# Altium schematic sheet CORE.SchDoc
size A3
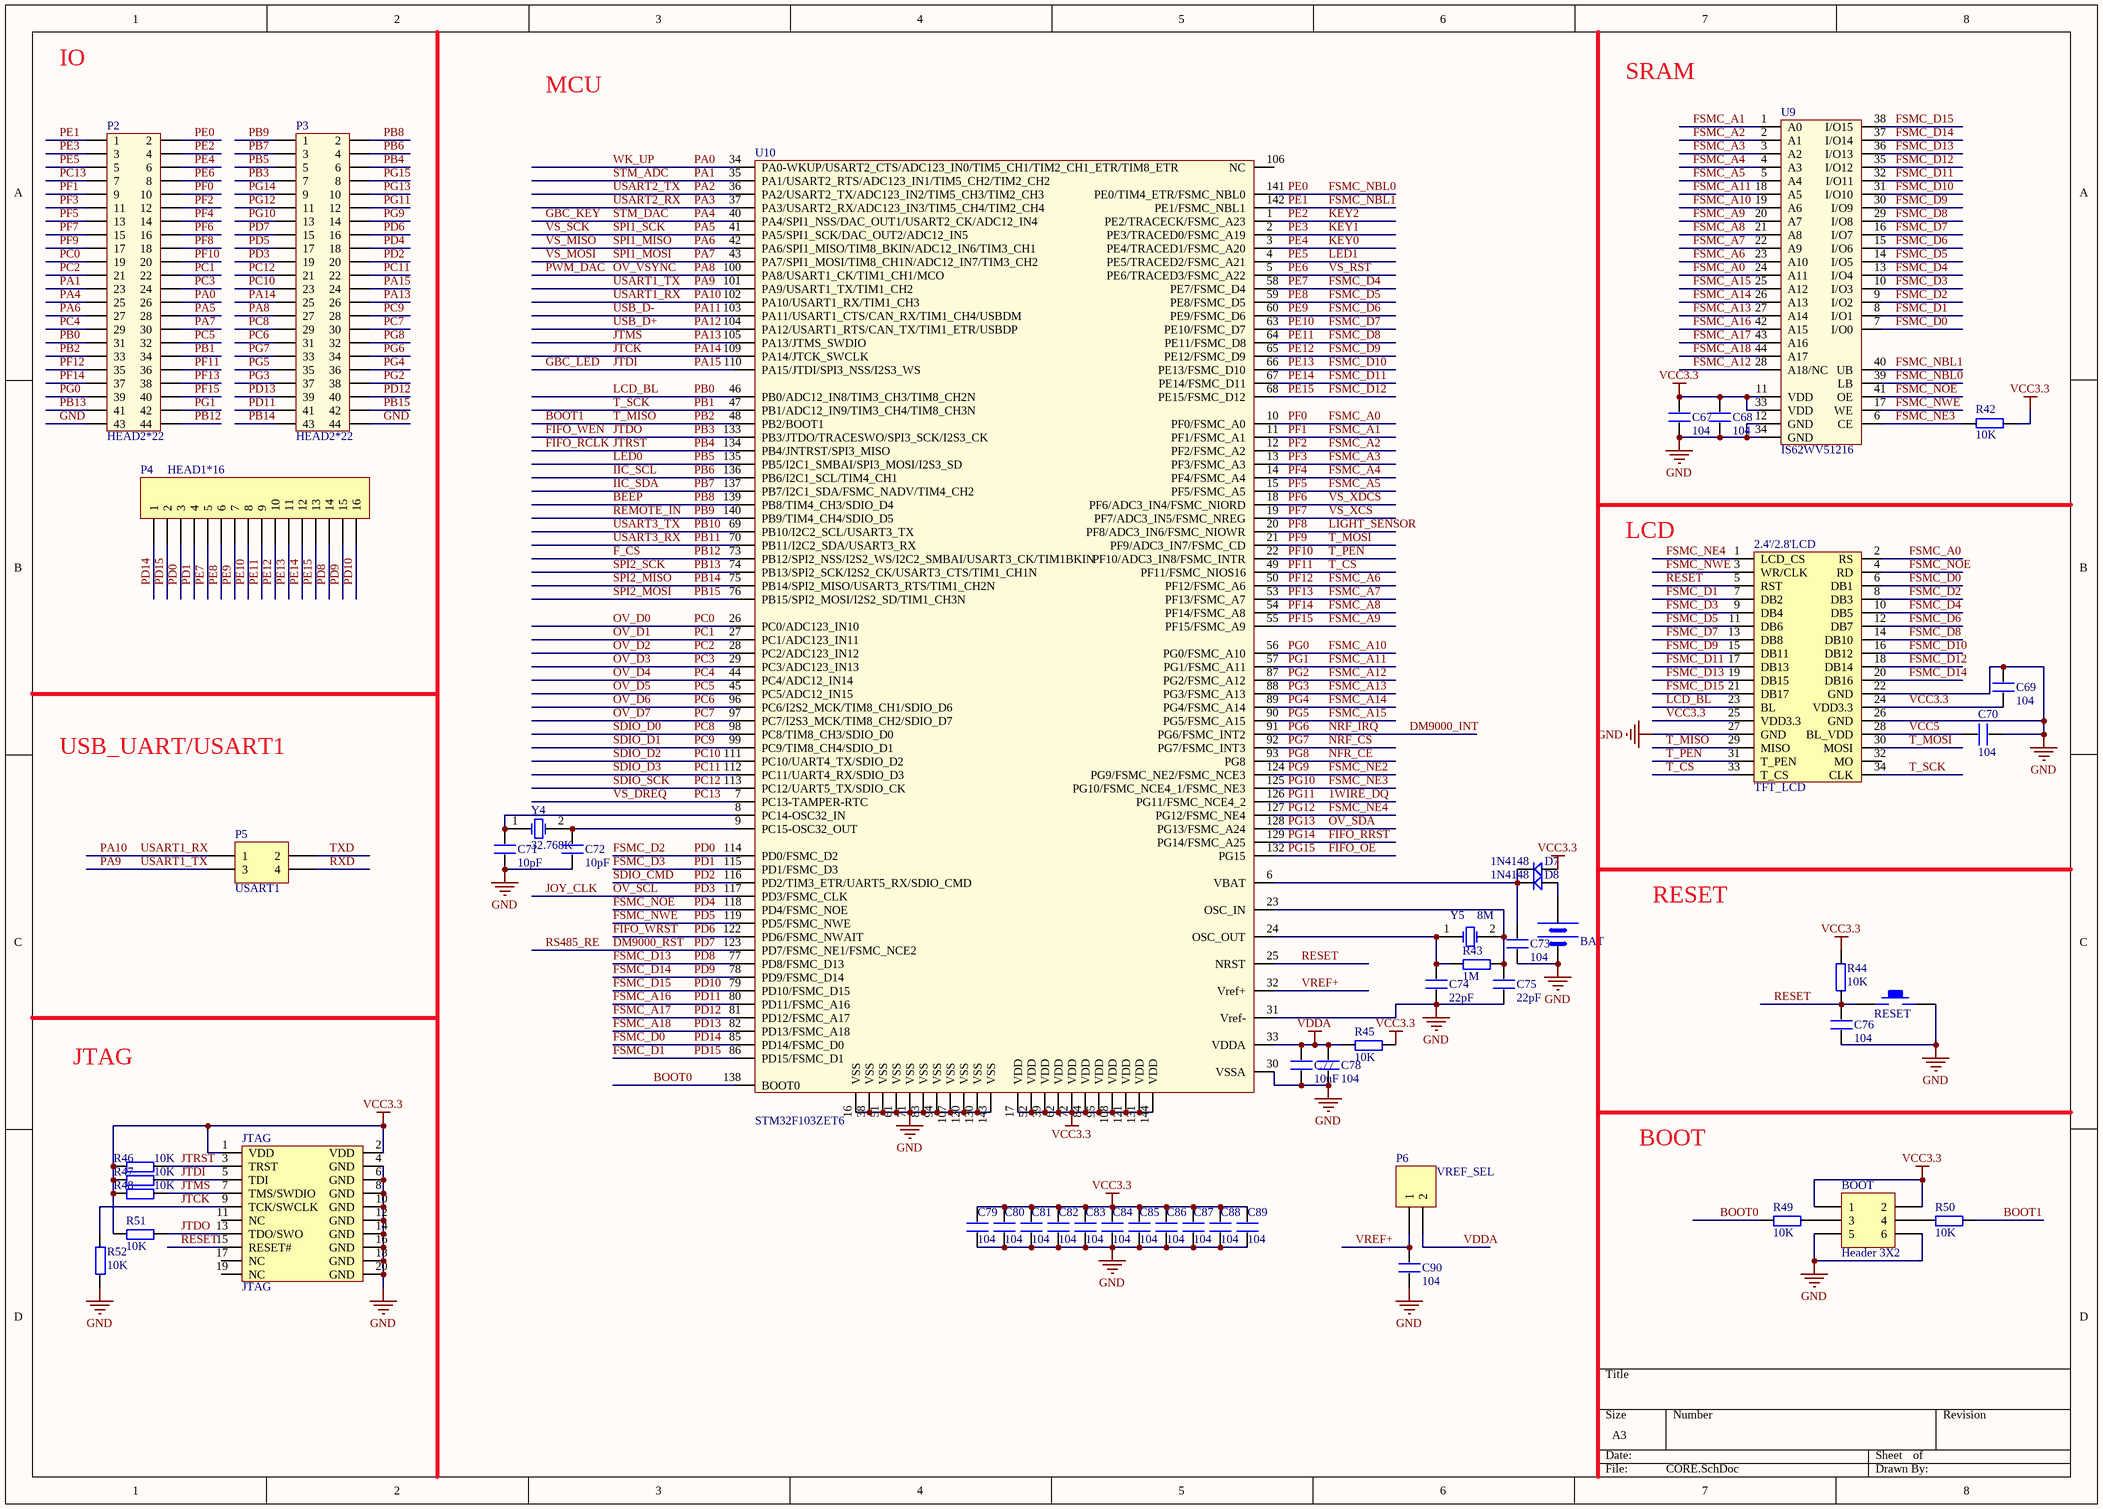
[diagram p0: CORE.SchDoc]

## Parts
2.4'/2.8'LCD  TFT_LCD  [db2*17-4.3]
BAT  BATT  [BATM]  (value not drawn)
BOOT  Header 3X2  [HDR2X3]
C67  104  [0603P]
C68  104  [0603P]
C69  104  [0603P]
C70  104  [0603P]
C71  10pF  [0603P]
C72  10pF  [0603P]
C73  104  [0603P]
C74  22pF  [0603P]
C75  22pF  [0603P]
C76  104  [0603P]
C77  10uF  [0603P]
C78  104  [0603P]
C79  104  [0603P]
C80  104  [0603P]
C81  104  [0603P]
C82  104  [0603P]
C83  104  [0603P]
C84  104  [0603P]
C85  104  [0603P]
C86  104  [0603P]
C87  104  [0603P]
C88  104  [0603P]
C89  104  [0603P]
C90  104  [0603P]
D7  1N4148  [DIODE_SOP]
D8  1N4148  [DIODE_SOP]
JTAG  JTAG  [JTAG_20]
P2  HEAD2*22  [HEAD2*22]
P3  HEAD2*22  [HEAD2*22]
P4  HEAD1*16  [HDR1X16]
P5  USART1  [HDR2X2]
P6  VREF_SEL  [HDR1X2]
R42  10K  [0603P]
R43  1M  [0603P]
R44  10K  [0603P]
R45  10K  [0603P]
R46  10K  [0603P]
R47  10K  [0603P]
R48  10K  [0603P]
R49  10K  [0603P]
R50  10K  [0603P]
R51  10K  [0603P]
R52  10K  [0603P]
RESET  KEY_M  [KEY_M]  (value not drawn)
U9  IS62WV51216  [TSOP44]
U10  STM32F103ZET6  [LQFP144]
Y4  32.768K  [XTAL_US]
Y5  8M  [XTAL_US]

## Nets
GND: 2.4'/2.8'LCD.22(GND) 2.4'/2.8'LCD.26(GND) 2.4'/2.8'LCD.27(GND) BAT.2(GND) BOOT.5 BOOT.6 C67.1 C68.1 C69.1 C70.1 C71.2 C72.2 C73.2 C74.2 C75.2 C76.2 C77.2 C78.2 C79.2 C80.2 C81.2 C82.2 C83.2 C84.2 C85.2 C86.2 C87.2 C88.2 C89.2 C90.2 JTAG.4(GND) JTAG.6(GND) JTAG.8(GND) JTAG.10(GND) JTAG.12(GND) JTAG.14(GND) JTAG.16(GND) JTAG.18(GND) JTAG.20(GND) P2.43 P3.44 R52.1 RESET.2 U9.12(GND) U9.34(GND) U10.16(VSS) U10.30(VSSA) U10.31(Vref-) U10.38(VSS) U10.51(VSS) U10.61(VSS) U10.71(VSS) U10.83(VSS) U10.94(VSS) U10.107(VSS) U10.120(VSS) U10.130(VSS) U10.143(VSS)
VCC3.3: 2.4'/2.8'LCD.24(VDD3.3) 2.4'/2.8'LCD.25(VDD3.3) BOOT.1 BOOT.2 C67.2 C68.2 C69.2 C79.1 C80.1 C81.1 C82.1 C83.1 C84.1 C85.1 C86.1 C87.1 C88.1 C89.1 D7.1 JTAG.1(VDD) JTAG.2(VDD) R42.1 R44.1 R45.2 R46.1 R47.1 R48.1 R51.1 U9.11(VDD) U9.33(VDD) U10.17(VDD) U10.39(VDD) U10.52(VDD) U10.62(VDD) U10.72(VDD) U10.84(VDD) U10.95(VDD) U10.108(VDD) U10.121(VDD) U10.131(VDD) U10.144(VDD)
VDDA: C77.1 C78.1 P6.2 R45.1 U10.33(VDDA)
1WIRE_DQ: P3.12 U10.126(PG11/FSMC_NCE4_2)  [also labelled PG11]
BEEP: P3.2 U10.139(PB8/TIM4_CH3/SDIO_D4)  [also labelled PB8]
BOOT0: R49.1 U10.138(BOOT0)
BOOT1: 2.4'/2.8'LCD.29(MISO) P2.33 R50.2 U10.48(PB2/BOOT1)  [also labelled PB2, T_MISO]
DM9000_INT: P3.34 U10.91(PG6/FSMC_INT2)  [also labelled NRF_IRQ, PG6]
DM9000_RST: P3.15 U10.123(PD7/FSMC_NE1/FSMC_NCE2)  [also labelled PD7, RS485_RE]
F_CS: P2.44 U10.73(PB12/SPI2_NSS/I2S2_WS/I2C2_SMBAI/USART3_CK/TIM1BKIN)  [also labelled PB12]
FIFO_OE: P3.8 U10.132(PG15)  [also labelled PG15]
FIFO_RCLK: JTAG.3(TRST) P3.6 R46.2 U10.134(PB4/JNTRST/SPI3_MISO)  [also labelled JTRST, PB4]
FIFO_RRST: P3.9 U10.129(PG14/FSMC_A25)  [also labelled PG14]
FIFO_WEN: JTAG.13(TDO/SWO) P3.7 R51.2 U10.133(PB3/JTDO/TRACESWO/SPI3_SCK/I2S3_CK)  [also labelled JTDO, PB3]
FIFO_WRST: P3.16 U10.122(PD6/FSMC_NWAIT)  [also labelled PD6]
FSMC_A0: 2.4'/2.8'LCD.2(RS) P2.10 U9.24(A11) U10.10(PF0/FSMC_A0)  [also labelled PF0]
FSMC_A1: P2.9 U9.1(A0) U10.11(PF1/FSMC_A1)  [also labelled PF1]
FSMC_A2: P2.12 U9.2(A1) U10.12(PF2/FSMC_A2)  [also labelled PF2]
FSMC_A3: P2.11 U9.3(A2) U10.13(PF3/FSMC_A3)  [also labelled PF3]
FSMC_A4: P2.14 U9.4(A3) U10.14(PF4/FSMC_A4)  [also labelled PF4]
FSMC_A5: P2.13 U9.5(A4) U10.15(PF5/FSMC_A5)  [also labelled PF5]
FSMC_A6: P2.35 U9.23(A10) U10.50(PF12/FSMC_A6)  [also labelled PF12]
FSMC_A7: P2.38 U9.22(A9) U10.53(PF13/FSMC_A7)  [also labelled PF13]
FSMC_A8: P2.37 U9.21(A8) U10.54(PF14/FSMC_A8)  [also labelled PF14]
FSMC_A9: P2.40 U9.20(A7) U10.55(PF15/FSMC_A9)  [also labelled PF15]
FSMC_A10: P2.39 U9.19(A6) U10.56(PG0/FSMC_A10)  [also labelled PG0]
FSMC_A11: P2.42 U9.18(A5) U10.57(PG1/FSMC_A11)  [also labelled PG1]
FSMC_A12: P3.38 U9.28(A18/NC) U10.87(PG2/FSMC_A12)  [also labelled PG2]
FSMC_A13: P3.37 U9.27(A14) U10.88(PG3/FSMC_A13)  [also labelled PG3]
FSMC_A14: P3.36 U9.26(A13) U10.89(PG4/FSMC_A14)  [also labelled PG4]
FSMC_A15: P3.35 U9.25(A12) U10.90(PG5/FSMC_A15)  [also labelled PG5]
FSMC_A16: P3.41 U9.42(A15) U10.80(PD11/FSMC_A16)  [also labelled PD11]
FSMC_A17: P3.40 U9.43(A16) U10.81(PD12/FSMC_A17)  [also labelled PD12]
FSMC_A18: P3.39 U9.44(A17) U10.82(PD13/FSMC_A18)  [also labelled PD13]
FSMC_D0: 2.4'/2.8'LCD.6(DB1) P4.1 U9.7(I/O0) U10.85(PD14/FSMC_D0)  [also labelled PD14]
FSMC_D1: 2.4'/2.8'LCD.7(DB2) P4.2 U9.8(I/O1) U10.86(PD15/FSMC_D1)  [also labelled PD15]
FSMC_D2: 2.4'/2.8'LCD.8(DB3) P4.3 U9.9(I/O2) U10.114(PD0/FSMC_D2)  [also labelled PD0]
FSMC_D3: 2.4'/2.8'LCD.9(DB4) P4.4 U9.10(I/O3) U10.115(PD1/FSMC_D3)  [also labelled PD1]
FSMC_D4: 2.4'/2.8'LCD.10(DB5) P4.5 U9.13(I/O4) U10.58(PE7/FSMC_D4)  [also labelled PE7]
FSMC_D5: 2.4'/2.8'LCD.11(DB6) P4.6 U9.14(I/O5) U10.59(PE8/FSMC_D5)  [also labelled PE8]
FSMC_D6: 2.4'/2.8'LCD.12(DB7) P4.7 U9.15(I/O6) U10.60(PE9/FSMC_D6)  [also labelled PE9]
FSMC_D7: 2.4'/2.8'LCD.13(DB8) P4.8 U9.16(I/O7) U10.63(PE10/FSMC_D7)  [also labelled PE10]
FSMC_D8: 2.4'/2.8'LCD.14(DB10) P4.9 U9.29(I/O8) U10.64(PE11/FSMC_D8)  [also labelled PE11]
FSMC_D9: 2.4'/2.8'LCD.15(DB11) P4.10 U9.30(I/O9) U10.65(PE12/FSMC_D9)  [also labelled PE12]
FSMC_D10: 2.4'/2.8'LCD.16(DB12) P4.11 U9.31(I/O10) U10.66(PE13/FSMC_D10)  [also labelled PE13]
FSMC_D11: 2.4'/2.8'LCD.17(DB13) P4.12 U9.32(I/O11) U10.67(PE14/FSMC_D11)  [also labelled PE14]
FSMC_D12: 2.4'/2.8'LCD.18(DB14) P4.13 U9.35(I/O12) U10.68(PE15/FSMC_D12)  [also labelled PE15]
FSMC_D13: 2.4'/2.8'LCD.19(DB15) P4.14 U9.36(I/O13) U10.77(PD8/FSMC_D13)  [also labelled PD8]
FSMC_D14: 2.4'/2.8'LCD.20(DB16) P4.15 U9.37(I/O14) U10.78(PD9/FSMC_D14)  [also labelled PD9]
FSMC_D15: 2.4'/2.8'LCD.21(DB17) P4.16 U9.38(I/O15) U10.79(PD10/FSMC_D15)  [also labelled PD10]
FSMC_NBL0: P2.2 U9.39(LB) U10.141(PE0/TIM4_ETR/FSMC_NBL0)  [also labelled PE0]
FSMC_NBL1: P2.1 U9.40(UB) U10.142(PE1/FSMC_NBL1)  [also labelled PE1]
FSMC_NE2: P3.14 U10.124(PG9/FSMC_NE2/FSMC_NCE3)  [also labelled PG9]
FSMC_NE3: P3.13 R42.2 U9.6(CE) U10.125(PG10/FSMC_NCE4_1/FSMC_NE3)  [also labelled PG10]
FSMC_NE4: 2.4'/2.8'LCD.1(LCD_CS) P3.11 U10.127(PG12/FSMC_NE4)  [also labelled PG12]
FSMC_NOE: 2.4'/2.8'LCD.4(RD) P3.18 U9.41(OE) U10.118(PD4/FSMC_NOE)  [also labelled PD4]
FSMC_NWE: 2.4'/2.8'LCD.3(WR/CLK) P3.17 U9.17(WE) U10.119(PD5/FSMC_NWE)  [also labelled PD5]
GBC_KEY: P2.25 U10.40(PA4/SPI1_NSS/DAC_OUT1/USART2_CK/ADC12_IN4)  [also labelled PA4, STM_DAC]
GBC_LED: JTAG.5(TDI) P3.24 R47.2 U10.110(PA15/JTDI/SPI3_NSS/I2S3_WS)  [also labelled JTDI, PA15]
IIC_SCL: P3.4 U10.136(PB6/I2C1_SCL/TIM4_CH1)  [also labelled PB6]
IIC_SDA: P3.3 U10.137(PB7/I2C1_SDA/FSMC_NADV/TIM4_CH2)  [also labelled PB7]
JOY_CLK: P3.19 U10.117(PD3/FSMC_CLK)  [also labelled OV_SCL, PD3]
JTCK: JTAG.9(TCK/SWCLK) P3.25 R52.2 U10.109(PA14/JTCK_SWCLK)  [also labelled PA14]
JTMS: JTAG.7(TMS/SWDIO) P3.26 R48.2 U10.105(PA13/JTMS_SWDIO)  [also labelled PA13]
KEY0: P2.6 U10.3(PE4/TRACED1/FSMC_A20)  [also labelled PE4]
KEY1: P2.3 U10.2(PE3/TRACED0/FSMC_A19)  [also labelled PE3]
KEY2: P2.4 U10.1(PE2/TRACECK/FSMC_A23)  [also labelled PE2]
LCD_BL: 2.4'/2.8'LCD.23(BL) P2.31 U10.46(PB0/ADC12_IN8/TIM3_CH3/TIM8_CH2N)  [also labelled PB0]
LED0: P3.5 U10.135(PB5/I2C1_SMBAI/SPI3_MOSI/I2S3_SD)  [also labelled PB5]
LED1: P2.5 U10.4(PE5/TRACED2/FSMC_A21)  [also labelled PE5]
LIGHT_SENSOR: P2.18 U10.20(PF8/ADC3_IN6/FSMC_NIOWR)  [also labelled PF8]
NFR_CE: P3.32 U10.93(PG8)  [also labelled PG8]
NRF_CS: P3.33 U10.92(PG7/FSMC_INT3)  [also labelled PG7]
OV_D0: P2.19 U10.26(PC0/ADC123_IN10)  [also labelled PC0]
OV_D1: P2.22 U10.27(PC1/ADC123_IN11)  [also labelled PC1]
OV_D2: P2.21 U10.28(PC2/ADC123_IN12)  [also labelled PC2]
OV_D3: P2.24 U10.29(PC3/ADC123_IN13)  [also labelled PC3]
OV_D4: P2.29 U10.44(PC4/ADC12_IN14)  [also labelled PC4]
OV_D5: P2.32 U10.45(PC5/ADC12_IN15)  [also labelled PC5]
OV_D6: P3.31 U10.96(PC6/I2S2_MCK/TIM8_CH1/SDIO_D6)  [also labelled PC6]
OV_D7: P3.30 U10.97(PC7/I2S3_MCK/TIM8_CH2/SDIO_D7)  [also labelled PC7]
OV_SDA: P3.10 U10.128(PG13/FSMC_A24)  [also labelled PG13]
OV_VSYNC: P3.27 U10.100(PA8/USART1_CK/TIM1_CH1/MCO)  [also labelled PA8, PWM_DAC]
PA0: P2.26 U10.34(PA0-WKUP/USART2_CTS/ADC123_IN0/TIM5_CH1/TIM2_CH1_ETR/TIM8_ETR)  [also labelled WK_UP]
PA1: P2.23 U10.35(PA1/USART2_RTS/ADC123_IN1/TIM5_CH2/TIM2_CH2)  [also labelled STM_ADC]
PA2: U10.36(PA2/USART2_TX/ADC123_IN2/TIM5_CH3/TIM2_CH3)  [also labelled USART2_TX]
PA3: U10.37(PA3/USART2_RX/ADC123_IN3/TIM5_CH4/TIM2_CH4)  [also labelled USART2_RX]
PA5: P2.28 U10.41(PA5/SPI1_SCK/DAC_OUT2/ADC12_IN5)  [also labelled SPI1_SCK, VS_SCK]
PA6: P2.27 U10.42(PA6/SPI1_MISO/TIM8_BKIN/ADC12_IN6/TIM3_CH1)  [also labelled SPI1_MISO, VS_MISO]
PA7: P2.30 U10.43(PA7/SPI1_MOSI/TIM8_CH1N/ADC12_IN7/TIM3_CH2)  [also labelled SPI1_MOSI, VS_MOSI]
PA9: P5.3 U10.101(PA9/USART1_TX/TIM1_CH2)  [also labelled USART1_TX]
PA10: P5.1 U10.102(PA10/USART1_RX/TIM1_CH3)  [also labelled USART1_RX]
PA11: U10.103(PA11/USART1_CTS/CAN_RX/TIM1_CH4/USBDM)  [also labelled USB_D-]
PA12: U10.104(PA12/USART1_RTS/CAN_TX/TIM1_ETR/USBDP)  [also labelled USB_D+]
PB1: 2.4'/2.8'LCD.34(CLK) P2.34 U10.47(PB1/ADC12_IN9/TIM3_CH4/TIM8_CH3N)  [also labelled T_SCK]
PB9: P3.1 U10.140(PB9/TIM4_CH4/SDIO_D5)  [also labelled REMOTE_IN]
PB10: U10.69(PB10/I2C2_SCL/USART3_TX)  [also labelled USART3_TX]
PB11: U10.70(PB11/I2C2_SDA/USART3_RX)  [also labelled USART3_RX]
PB13: P2.41 U10.74(PB13/SPI2_SCK/I2S2_CK/USART3_CTS/TIM1_CH1N)  [also labelled SPI2_SCK]
PB14: P3.43 U10.75(PB14/SPI2_MISO/USART3_RTS/TIM1_CH2N)  [also labelled SPI2_MISO]
PB15: P3.42 U10.76(PB15/SPI2_MOSI/I2S2_SD/TIM1_CH3N)  [also labelled SPI2_MOSI]
PC8: P3.29 U10.98(PC8/TIM8_CH3/SDIO_D0)  [also labelled SDIO_D0]
PC9: P3.28 U10.99(PC9/TIM8_CH4/SDIO_D1)  [also labelled SDIO_D1]
PC10: P3.23 U10.111(PC10/UART4_TX/SDIO_D2)  [also labelled SDIO_D2]
PC11: P3.22 U10.112(PC11/UART4_RX/SDIO_D3)  [also labelled SDIO_D3]
PC12: P3.21 U10.113(PC12/UART5_TX/SDIO_CK)  [also labelled SDIO_SCK]
PC13: P2.7 U10.7(PC13-TAMPER-RTC)  [also labelled VS_DREQ]
PD2: P3.20 U10.116(PD2/TIM3_ETR/UART5_RX/SDIO_CMD)  [also labelled SDIO_CMD]
PE6: P2.8 U10.5(PE6/TRACED3/FSMC_A22)  [also labelled VS_RST]
PF6: P2.16 U10.18(PF6/ADC3_IN4/FSMC_NIORD)  [also labelled VS_XDCS]
PF7: P2.15 U10.19(PF7/ADC3_IN5/FSMC_NREG)  [also labelled VS_XCS]
PF9: 2.4'/2.8'LCD.30(MOSI) P2.17 U10.21(PF9/ADC3_IN7/FSMC_CD)  [also labelled T_MOSI]
PF10: 2.4'/2.8'LCD.31(T_PEN) P2.20 U10.22(PF10/ADC3_IN8/FSMC_INTR)  [also labelled T_PEN]
PF11: 2.4'/2.8'LCD.33(T_CS) P2.36 U10.49(PF11/FSMC_NIOS16)  [also labelled T_CS]
RESET: 2.4'/2.8'LCD.5(RST) C76.1 JTAG.15(RESET#) R44.2 RESET.1 U10.25(NRST)
RXD: P5.4
TXD: P5.2
VCC5: 2.4'/2.8'LCD.28(BL_VDD) C70.2
VREF+: C90.1 P6.1 U10.32(Vref+)
NetBAT_1: BAT.1(VCC) D8.1
NetBOOT_3: BOOT.3 R49.2
NetBOOT_4: BOOT.4 R50.1
NetC71_1: C71.1 U10.8(PC14-OSC32_IN) Y4.1(OSC1)
NetC72_1: C72.1 U10.9(PC15-OSC32_OUT) Y4.2(OSC2)
NetC73_1: C73.1 D7.2 D8.2 U10.6(VBAT)
NetC74_1: C74.1 R43.1 U10.24(OSC_OUT) Y5.1(OSC1)
NetC75_1: C75.1 R43.2 U10.23(OSC_IN) Y5.2(OSC2)

Not connected (* = marked no-connect by the designer): 2.4'/2.8'LCD 32(MO); JTAG 11(NC) 17(NC) 19(NC); U10 106(NC)

## Notes on the sheet
- IO
- MCU
- SRAM
- LCD
- USB_UART/USART1
- RESET
- JTAG
- BOOT

## Library data of the parts
BAT = BAT
BOOT = Header 3X2: Header, 3-Pin, Dual row; LatestRevisionDate: 17-Jul-2002; LatestRevisionNote: Re-released for DXP Platform.; Publisher: Altium Limited
C67-C90 = C
D7 D8 = D
P4 = Header 16: Header, 16-Pin; LatestRevisionDate: 17-Jul-2002; LatestRevisionNote: Re-released for DXP Platform.; Publisher: Altium Limited
P5 = Header 2X2: Header, 2-Pin, Dual row; LatestRevisionDate: 17-Jul-2002; LatestRevisionNote: Re-released for DXP Platform.; Publisher: Altium Limited
P6 = Header 2: Header, 2-Pin; LatestRevisionDate: 17-Jul-2002; LatestRevisionNote: Re-released for DXP Platform.; Publisher: Altium Limited
R42-R52 = R
U9 = IS61LV51216
Y4 Y5 = XTAL: Crystal Oscillator; Published: 8-Jun-2000; LatestRevisionDate: 17-Jul-2002; LatestRevisionNote: Re-released for DXP Platform.; Publisher: Altium Limited